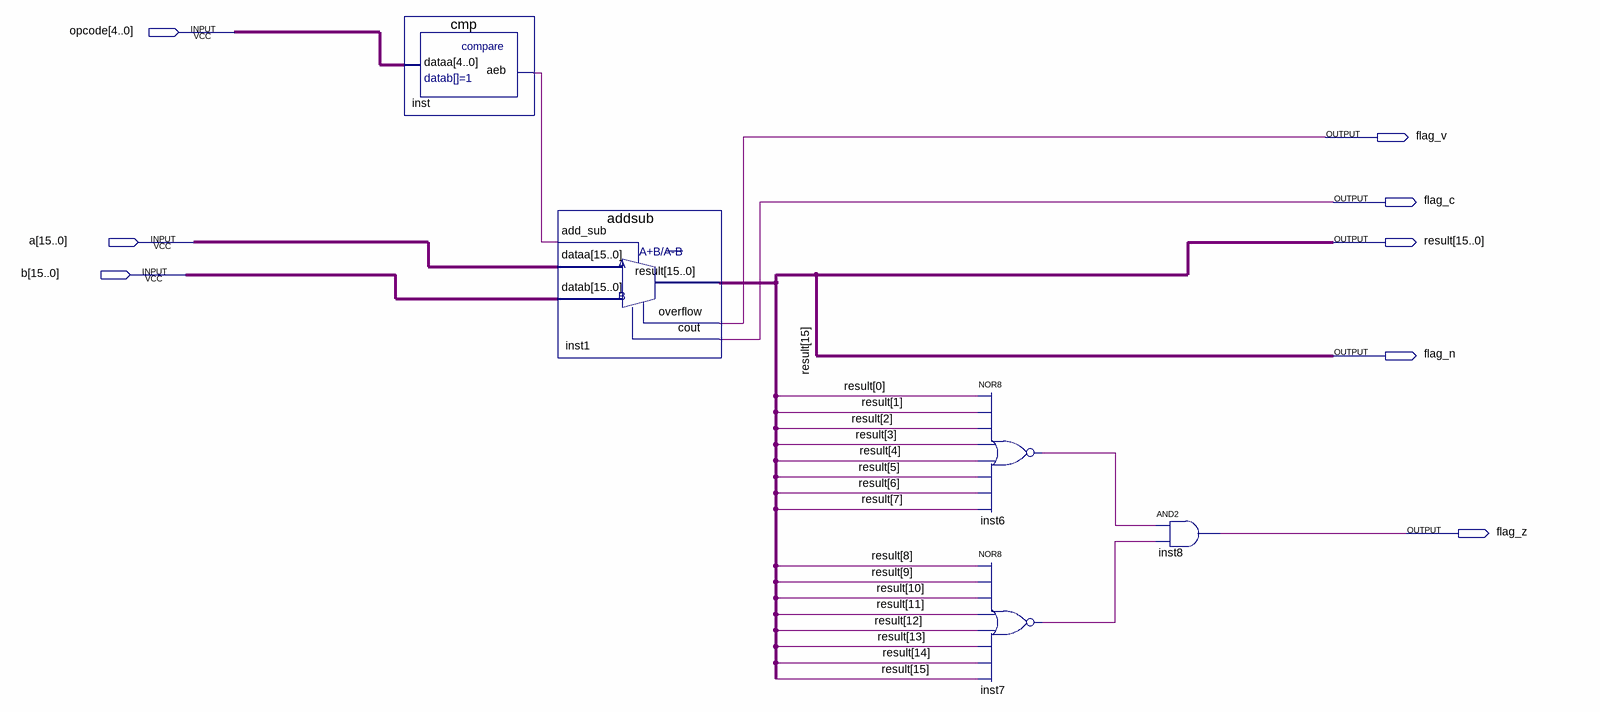
[diagram p0: schematic sheet]
// Quartus schematic alu.bdf as structural Verilog: 5 symbols, 8 pins
module alu (
  input  [4:0] opcode,
  input  [15:0] a,
  input  [15:0] b,
  output flag_v,
  output flag_c,
  output [15:0] result,
  output flag_n,
  output flag_z
);

  wire inst6_out, inst7_out, inst_aeb;

  cmp inst (.dataa(opcode), .aeb(inst_aeb));
  addsub inst1 (
    .add_sub(inst_aeb), .dataa(a), .datab(b), .result({flag_n, result[14:0]}), .overflow(flag_v),
    .cout(flag_c));
  nor inst6 (inst6_out, result[0], result[1], result[2], result[3], result[4], result[5], result[6], result[7]);
  nor inst7 (inst7_out, result[8], result[9], result[10], result[11], result[12], result[13], result[14], flag_n);
  and inst8 (flag_z, inst6_out, inst7_out);

  assign result[15] = flag_n;
endmodule
